# Altium schematic sheet Cegep2.schdoc: TITRE
size Letter; ApprovedBy: APPROUVÉ PAR; Organization: Cegep Limoilou; Address1: 1300, 8e Avenue; Address2: Québec, QC; Address3: Canada; Address4: G1J 5L5; SheetNumber: 3; SheetTotal: 3
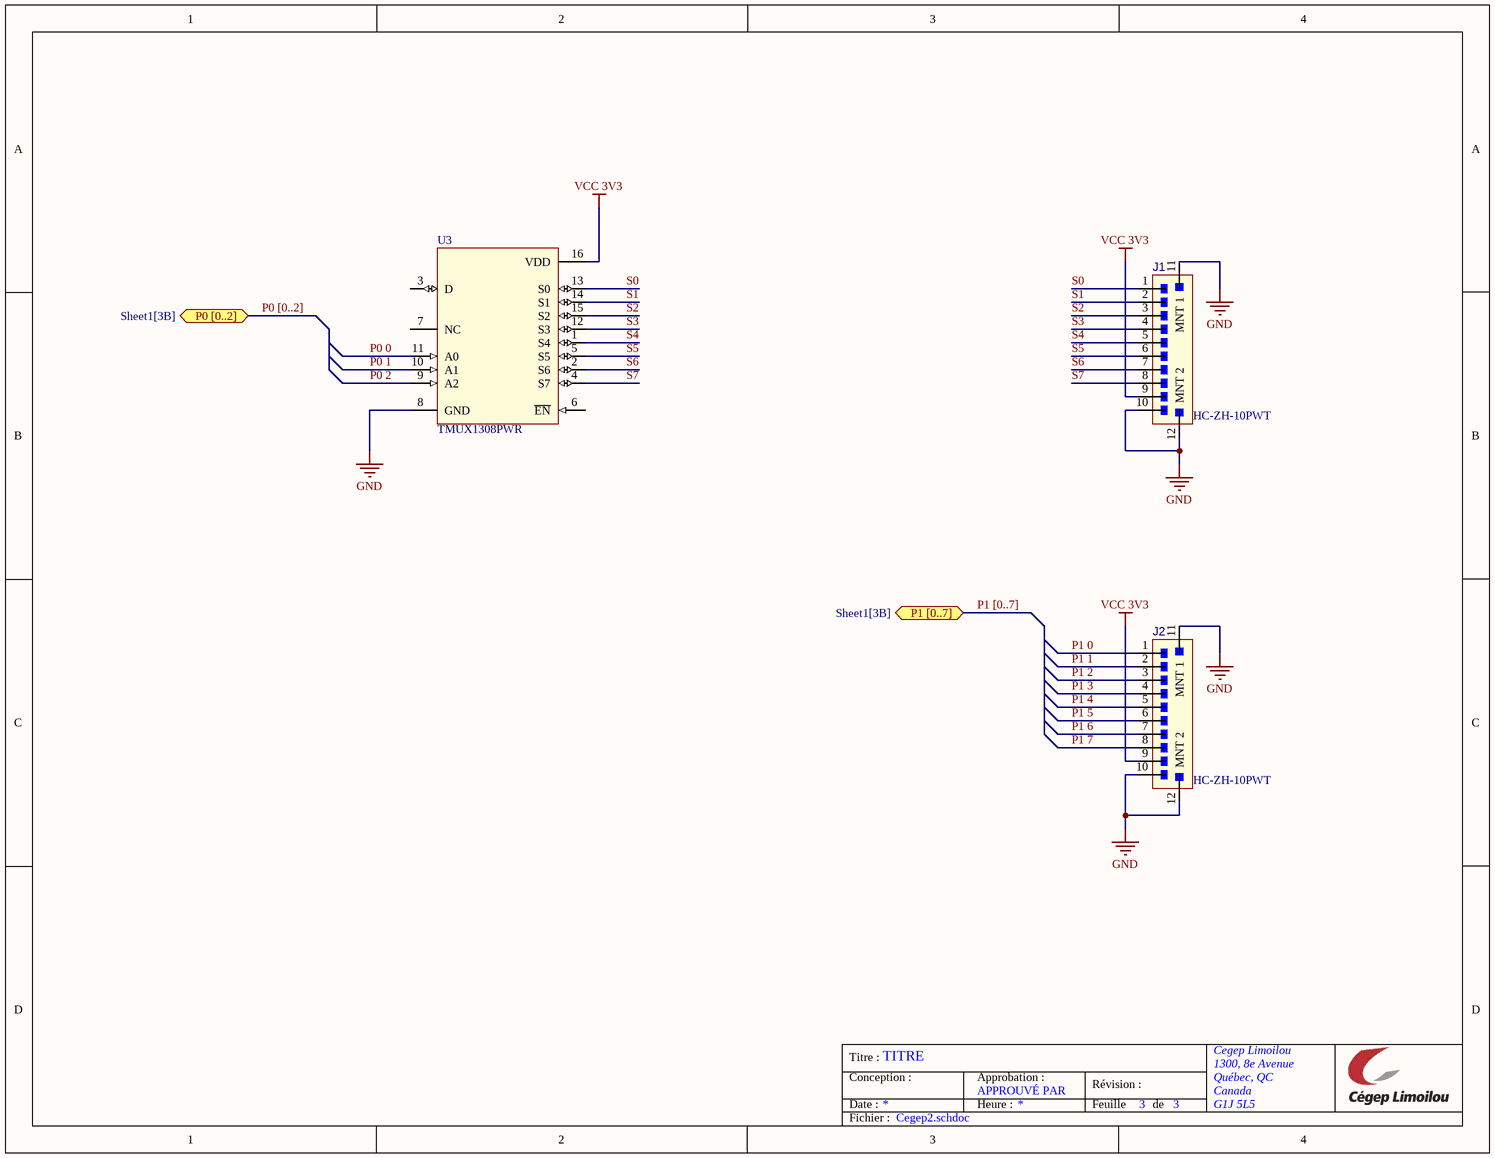
[diagram p0: Cegep2.schdoc]

## Parts
J1  HC-ZH-10PWT  [J_S10B-ZR-SM4]
J2  HC-ZH-10PWT  [J_S10B-ZR-SM4]
U3  TMUX1308PWR  [U_TSSOP65P500X450-16]

## Ports
P0 [0..2] (bidir, see Sheet1[3B]), P1 [0..7] (bidir, see Sheet1[3B])

## Nets
GND: J1.10 J1.11(MNT_1) J1.12(MNT_2) J2.10 J2.11(MNT_1) J2.12(MNT_2) U3.8(GND)
VCC 3V3: J1.9 J2.9 U3.16(VDD)
P0 0: U3.11(A0)
P0 1: U3.10(A1)
P0 2: U3.9(A2)
P1 0: J2.1
P1 1: J2.2
P1 2: J2.3
P1 3: J2.4
P1 4: J2.5
P1 5: J2.6
P1 6: J2.7
P1 7: J2.8
S0: J1.1 U3.13(S0)
S1: J1.2 U3.14(S1)
S2: J1.3 U3.15(S2)
S3: J1.4 U3.12(S3)
S4: J1.5 U3.1(S4)
S5: J1.6 U3.5(S5)
S6: J1.7 U3.2(S6)
S7: J1.8 U3.4(S7)

Not connected (* = marked no-connect by the designer): U3 3(D) 6(~{EN}) 7(NC)

## Buses and harness runs
bus P0 [0..2] = port P0 [0..2]
bus P1 [0..7] = port P1 [0..7]

## Notes on the sheet
- Titre :
- Conception :
- Date :
- Approbation :
- Heure :
- Révision :
- Feuille
- de
- Fichier :

## Library data of the parts
J1 J2 = CONN-1MM5-01X10-S10B-H-SMT: CONN wire to board SMT R/A 10POS 1.5mm; Manufacturer 1: HCTL; Manufacturer Part Number 1: HC-ZH-10PWT; Manufacturer 2: JST; Manufacturer Part Number 2: S10B-ZR-SM4A-TF(LF)(SN); Mounting Technology: SMT; Supplier 1: LCSC; Supplier 2: LCSC; Supplier Part Number 1: C2845432; Supplier Part Number 2: C5149249; Supplier 3: Digikey; Supplier Part Number 3: 455-1700-1-ND
U3 = U_TMUX1308PWR: IC MUX 8:1 195OHM 16TSSOP; Manufacturer 1: TI; Manufacturer Part Number 1: TMUX1308PWR; Mounting Technology: SMT; Supplier 1: LCSC; Supplier 2: Digikey; Supplier Part Number 1: C970231; Supplier Part Number 2: 296-TMUX1308PWRCT-ND